# EAGLE schematic SolarPwrOptions (EAGLE 7.6.0)
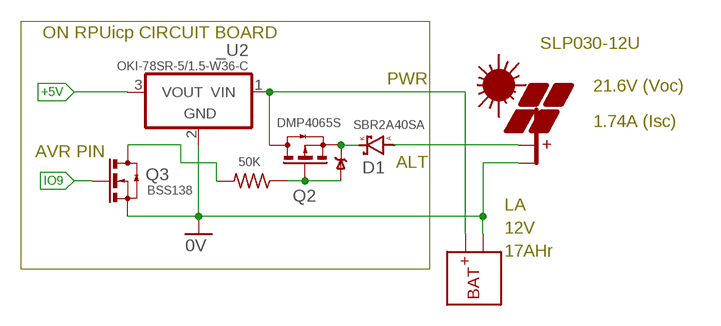
[diagram p0: schematic, sheet 1]

## Parts
_U2  OKI-78SR-5/1.5-W36-C  OKI-78SR-H  [OKI-78SR-H]
D1  SBR2A40SA  DSMB  [SMB]
D3  TVSSMC  [SMC]
PV2  PV  [NA-30]
Q2  DMP4065S  N-CHDPAK  [DPAK]
Q3  BSS138  N-CHDPAK  [DPAK]
R2  50K  R0805  [C0805(2012)]
U$1  BAT  [NA-30]

## Nets
0V: _U2.2(GND) PV2.2(-PV) Q3.3(S) U$1.2(-BAT)
+5V: _U2.3(VOUT)
IO9: Q3.1(G)
N$1: D1.K D3.C Q2.3(S)
N$2: _U2.1(VIN) Q2.SINK(D) U$1.1(+BAT)
N$3: D3.A Q2.1(G) R2.1
N$5: Q3.SINK(D) R2.2
N$7: D1.A PV2.1(+PV)

## Notes on the sheet
- ON RPUicp CIRCUIT BOARD
- SLP030-12U
- PWR
- 21.6V (Voc)
- 1.74A (Isc)
- AVR PIN
- ALT
- LA
- 12V
- 17AHr

## Library data of the parts
_U2 = P-DCDC:OKI-78SR: OKI-78SR OKI-78SR-5/1.5-W36H-C 5V@1.5A Horizontal Mount OKI-78SR-5/1.5-W36-C 5V@1.5A Vert Mount OKI-78SR-3.3/1.5-W36H-C 3.3V@1.5A Horizontal Mount OKI-78SR-3.3/1.5-W36-C 3.3V@1.5A Vert Mount Murata Power Solutions 7 to 36 VDC input range need to verify pinout
D1 = D-SBR:D: DIODE
D3 = D-TVS:TVS: Transient Voltage Suppressors
PV2 = Documentation:PV
Q2 = Q-PCH:N-CH?*: ENHANCEMENT MODE MOSFET SOT23 is BSS138 pinout
Q3 = Q-NCH:N-CH?*: ENHANCEMENT MODE MOSFET SOT23 is BSS138 pinout
R2 = R-C:R: Resiistor American-style symbol
U$1 = Documentation:BAT